# EAGLE design FeedBack (EAGLE 7.3.0)
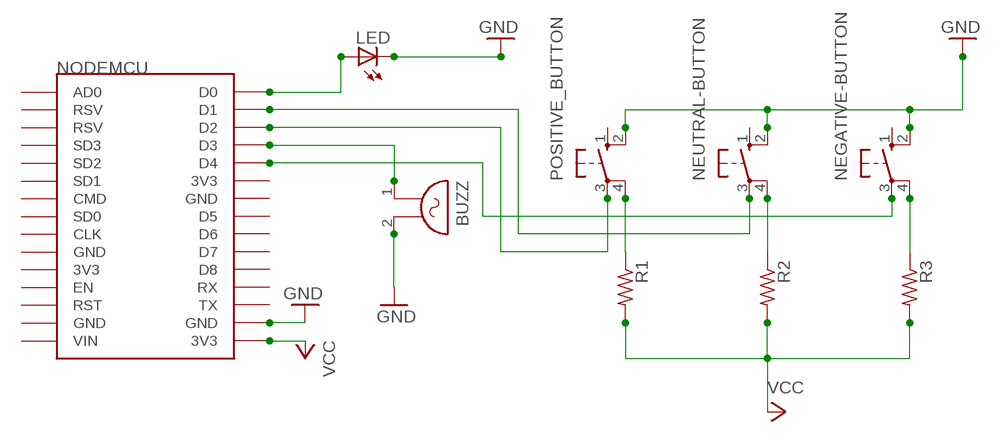
[diagram p0: schematic, sheet 1]

## Parts
BUZZ  F/HGP  [F/HGP]
LED  LED3MM  [LED3MM]
NEGATIVE-BUTTON  10-XX  [B3F-10XX]
NEUTRAL-BUTTON  10-XX  [B3F-10XX]
NODEMCU  ESP12E_DEVKIT  [ESP12E_DEVKIT]
POSITIVE_BUTTON  10-XX  [B3F-10XX]
R1  R-US_0204/5  [0204/5]
R2  R-US_0204/5  [0204/5]
R3  R-US_0204/5  [0204/5]

## Nets
GND: BUZZ.2 LED.K(C) NEGATIVE-BUTTON.2(S1) NEUTRAL-BUTTON.2(S1) NODEMCU.GND@3(GND) POSITIVE_BUTTON.2(S1)
N$3: POSITIVE_BUTTON.4(P1) R1.1
N$4: NEUTRAL-BUTTON.4(P1) R2.1
N$5: NEGATIVE-BUTTON.4(P1) R3.1
N$6: BUZZ.1 NODEMCU.D3
N$7: NEUTRAL-BUTTON.3(P) NODEMCU.D1
N$8: NODEMCU.D2 POSITIVE_BUTTON.3(P)
N$9: NEGATIVE-BUTTON.3(P) NODEMCU.D4
N$10: LED.A NODEMCU.D0
VCC: NODEMCU.3V3@2(3V3) R1.2 R2.2 R3.2
Unconnected: NEGATIVE-BUTTON.1(S) NEUTRAL-BUTTON.1(S) NODEMCU.3V3@0(3V3) NODEMCU.3V3@1(3V3) NODEMCU.AD0 NODEMCU.CLK NODEMCU.CMD NODEMCU.D5 NODEMCU.D6 NODEMCU.D7 NODEMCU.D8 NODEMCU.EN NODEMCU.GND@0(GND) NODEMCU.GND@1(GND) NODEMCU.GND@2(GND) NODEMCU.RST NODEMCU.RSV@0(RSV) NODEMCU.RSV@1(RSV) NODEMCU.RX NODEMCU.SD0 NODEMCU.SD1 NODEMCU.SD2 NODEMCU.SD3 NODEMCU.TX NODEMCU.VIN POSITIVE_BUTTON.1(S)

## Library data of the parts
BUZZ = buzzer:F/HGP: BUZZER Source: Buerklin; OC_FARNELL: unknown; OC_NEWARK: unknown
LED = adafruit:LED: LED OSRAM: - CHIPLED LG R971, LG N971, LY N971, LG Q971, LY Q971, LO R971, LY R971 LH N974, LH R974 LS Q976, LO Q976, LY Q976 LO Q996 - Hyper CHIPLED LW Q18S LB Q993, LB Q99A, LB R99A - SideLED LS A670, LO A670, LY A670, LG A670, LP A670 LB A673, LV A673, LT A673, LW A673 LH A674 LY A675 LS A676, LA A676, LO A676, LY A676, LW A676 LS A679, LY A679, LG A679 - Hyper Micro SIDELED® LS Y876, LA Y876, LO Y876, LY Y876 LT Y87S - SmartLED LW L88C, LW L88S LB L89C, LB L89S, LG L890 LS L89K, LO L89K, LY L89K LS L896, LA L896, LO L896, LY L896 - TOPLED LS T670, LO T670, LY T670, LG T670, LP T670 LSG T670, LSP T670, LSY T670, LOP T670, LYG T670 LG T671, LOG T671, LSG T671 LB T673, LV T673, LT T673, LW T673 LH T674 LS T676, LA T676, LO T676, LY T676, LB T676, LH T676, LSB T676, LW T676 LB T67C, LV T67C, LT T67C, LS T67K, LO T67K, LY T67K, LW E67C LS E67B, LA E67B, LO E67B, LY E67B, LB E67C, LV E67C, LT E67C LW T67C LS T679, LY T679, LG T679 LS T770, LO T770, LY T770, LG T770, LP T770 LB T773, LV T773, LT T773, LW T773 LH T774 LS E675, LA E675, LY E675, LS T675 LS T776, LA T776, LO T776, LY T776, LB T776 LHGB T686 LT T68C, LB T68C - Hyper Mini TOPLED® LB M676 - Mini TOPLED Santana® LG M470 LS M47K, LO M47K, LY M47K Source: http://www.osram.convergy.de/
NEGATIVE-BUTTON NEUTRAL-BUTTON POSITIVE_BUTTON = switch-omron:10-XX: OMRON SWITCH; MPN: B3F-1000; OC_FARNELL: 176432; OC_NEWARK: 36M3542
NODEMCU = ESP12E_DEVKIT:ESP12E_DEVKIT: ESP12E DEVKIT BOARD
R1-R3 = adafruit:R-US_: RESISTOR, American symbol

## Net classes
0 default: width 0.025 mm, drill 0.025 mm, clearance 0.025 mm

## Board
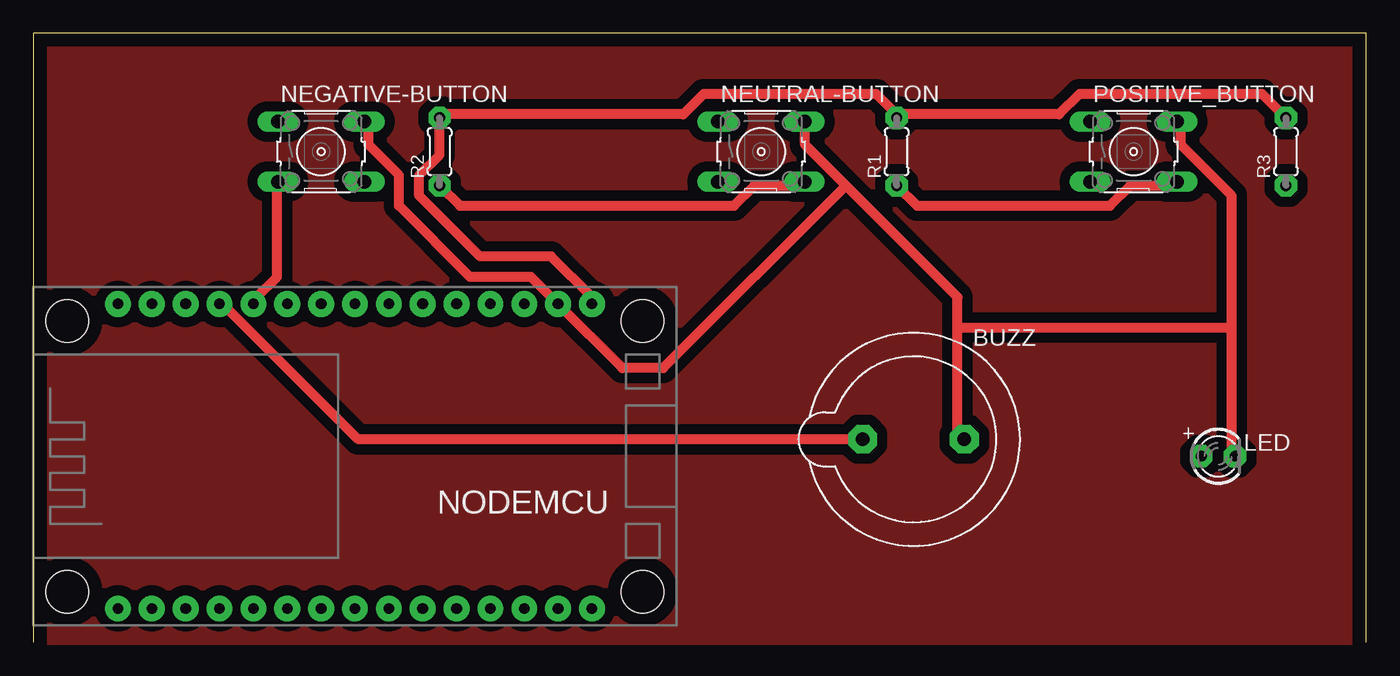
[diagram p1: board, top side]
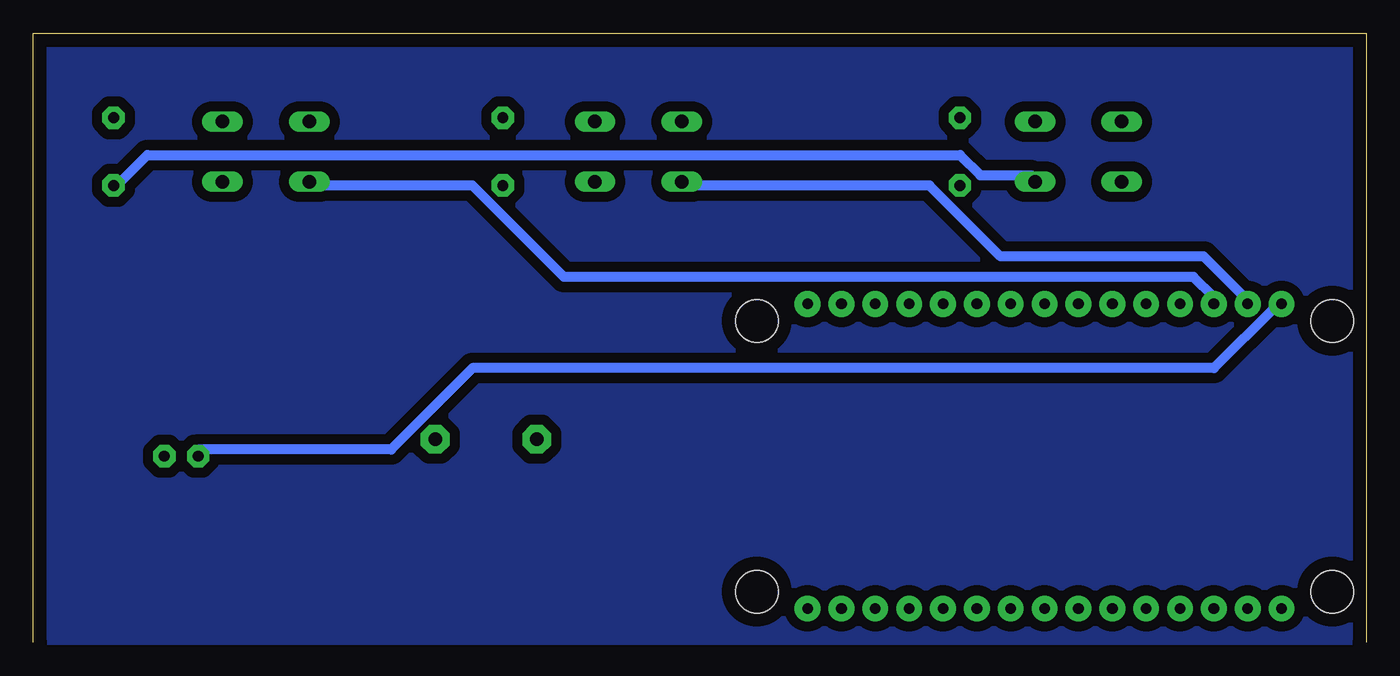
[diagram p2: board, bottom side, seen from below]

Size 100 x 45.71 mm. Coordinates in mm from the lower left corner, seen from the top.
Outline: 100,0 100,45.71 0,45.71 0,0
Copper layers (1*16): Top 0.035mm / dielectric 1.5mm / Bottom 0.035mm
Design rules "default *": minimum track width 30mil, minimum drill 24mil, track to track 30mil, track to pad 8mil, pad to pad 8mil, via to via 8mil, smd to smd 8mil, copper to edge 40mil, drill to drill 8mil, minimum pad ring 10mil, minimum via ring 8mil, stop-mask expansion 4mil, vias tented up to drill 0mil, thermal gap 10mil

### Footprints (pad centres in the part's own frame; a part is rotated, then mirrored left to right if it is on the bottom)
F/HGP = drill 1.016 pad 2.159 octagon: 1 -3.81,0; 2 3.81,0
LED3MM = drill 0.813 pad 1.676 octagon: A -1.27,0; K 1.27,0
B3F-10XX = drill 1.016 long: 1 -3.251,2.261; 2 3.251,2.261; 3 -3.251,-2.261; 4 3.251,-2.261
ESP12E_DEVKIT = drill 0.8 pad 1.93: 3V3@0 -11.43,-7.62; 3V3@1 11.43,5.08; 3V3@2 11.43,-17.78; AD0 -11.43,17.78; CLK -11.43,-2.54; CMD -11.43,2.54; D0 11.43,17.78; D1 11.43,15.24; D2 11.43,12.7; D3 11.43,10.16; D4 11.43,7.62; D5 11.43,0; D6 11.43,-2.54; D7 11.43,-5.08; D8 11.43,-7.62; EN -11.43,-10.16; GND@0 -11.43,-5.08; GND@1 -11.43,-15.24; GND@2 11.43,2.54; GND@3 11.43,-15.24; RST -11.43,-12.7; RSV@0 -11.43,15.24; RSV@1 -11.43,12.7; RX 11.43,-10.16; SD0 -11.43,0; SD1 -11.43,5.08; SD2 -11.43,7.62; SD3 -11.43,10.16; TX 11.43,-12.7; VIN -11.43,-17.78 | hole 3.2: -10.16,21.59; 10.16,21.59; 10.16,-21.59; -10.16,-21.59
0204/5 = drill 0.813 pad 1.676 octagon: 1 -2.54,0; 2 2.54,0

### Placement (x,y rotation side)
BUZZ  66.04,15.24 0 top
LED  88.9,13.97 0 top
NEGATIVE-BUTTON  21.59,36.83 0 top
NEUTRAL-BUTTON  54.61,36.83 0 top
NODEMCU  24.13,13.97 90 top
POSITIVE_BUTTON  82.55,36.83 0 top
R1  64.77,36.83 90 top
R2  30.48,36.83 90 top
R3  93.98,36.83 90 top

### Tracks (layer width: path | path; a pad name or v marks a point on that pad's centre or on a via)
GND
  Top 0.762: 89.92,23.62 89.92,14.48 LED.K | 89.92,23.62 89.92,33.53 86.11,37.34 86.11,38.86 POSITIVE_BUTTON.2 | NEGATIVE-BUTTON.2 25.15,38.86 25.15,37.34 27.43,35.05 27.43,32.77 32.77,27.43 37.34,27.43 NODEMCU.GND@3 44.2,20.57 47.24,20.57 60.96,34.29 | 60.96,34.29 69.34,25.91 69.34,23.62 | 60.96,34.29 57.91,37.34 57.91,38.86 NEUTRAL-BUTTON.2 | 69.34,23.62 69.34,15.24 BUZZ.2 | 69.34,23.62 89.92,23.62
N$1
  pour Bottom: 0,45.72 100.33,45.72 100.33,0 0,0
N$2
  pour Top: 0,45.72 100.33,45.72 100.33,0 0,0
N$3
  Top 0.762: R1.1 66.29,32.77 80.77,32.77 82.3,34.29 85.34,34.29 POSITIVE_BUTTON.4
N$4
  Top 0.762: R2.1 32,32.77 52.58,32.77 54.1,34.29 57.15,34.29 NEUTRAL-BUTTON.4
N$5
  Bottom 0.762: NEGATIVE-BUTTON.4 25.15,35.05 28.96,35.05 30.48,36.58 91.44,36.58 93.73,34.29 R3.1
N$6
  Top 0.762: BUZZ.1 24.38,15.24 14.48,25.15 NODEMCU.D3
N$7
  Bottom 0.762: NEUTRAL-BUTTON.3 51.05,34.29 32.77,34.29 27.43,28.96 12.19,28.96 9.14,25.91 NODEMCU.D1
N$8
  Bottom 0.762: POSITIVE_BUTTON.3 79.25,34.29 67.06,34.29 60.2,27.43 12.95,27.43 11.43,25.91 NODEMCU.D2
N$9
  Top 0.762: NEGATIVE-BUTTON.3 18.29,34.29 18.29,27.43 16.76,25.91 NODEMCU.D4
N$10
  Bottom 0.762: LED.A 87.63,14.48 73.15,14.48 67.06,20.57 11.43,20.57 6.86,25.15 NODEMCU.D0
VCC
  Top 0.762: NODEMCU.3V3@2 41.91,25.91 38.86,28.96 33.53,28.96 28.96,33.53 28.96,35.05 30.48,36.58 R2.2 30.48,39.62 48.77,39.62 50.29,41.15 63.25,41.15 64.77,39.62 | 64.77,39.62 76.96,39.62 78.49,41.15 92.2,41.15 R3.2 | 64.77,39.62 R1.2